# EAGLE design ZED-F9P GNSS FeatherWing (EAGLE 9.4.1)
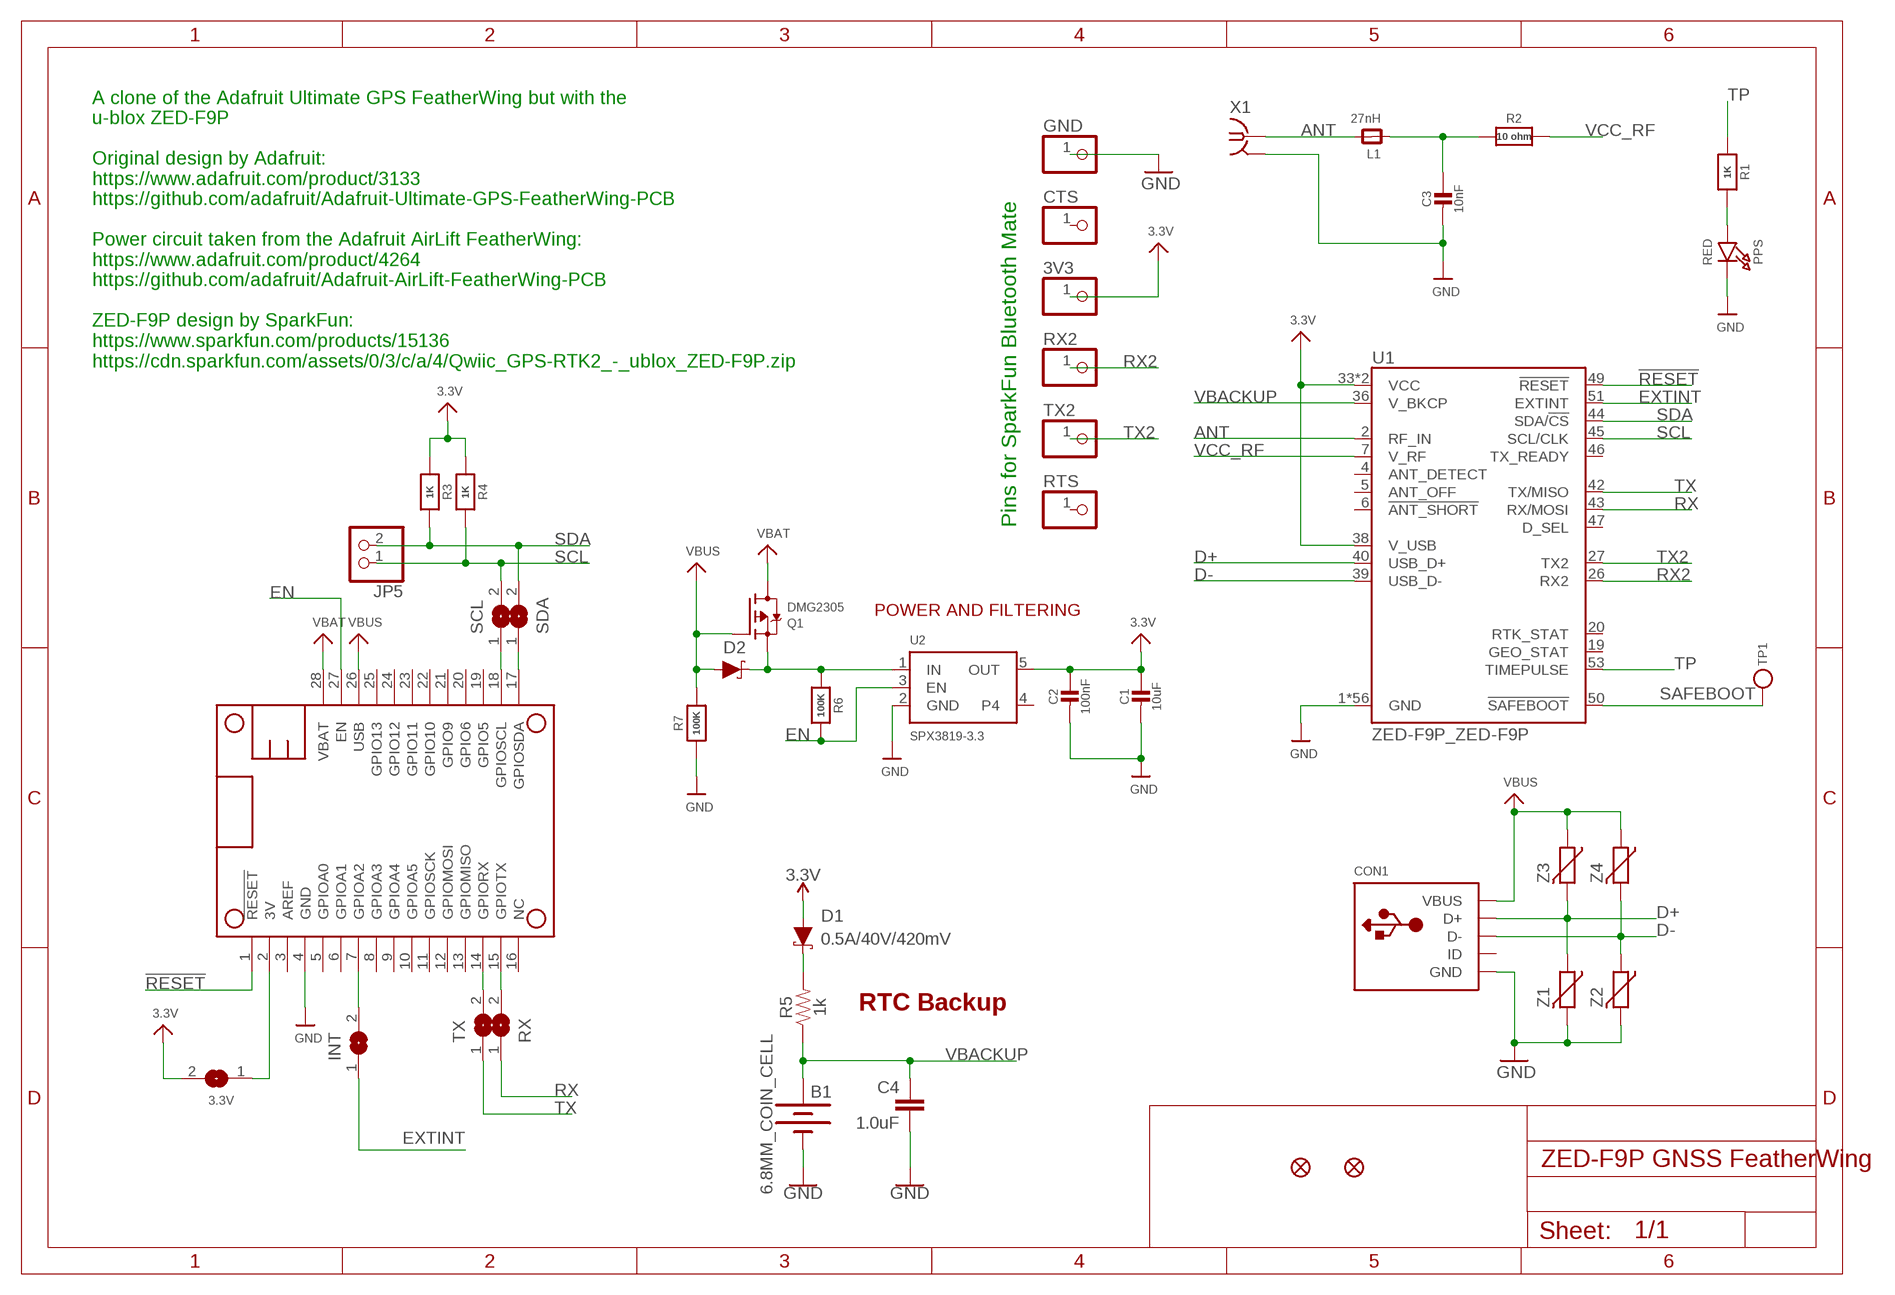
[diagram p0: schematic, sheet 1]

## Parts
3.3V  SOLDERJUMPER  [SOLDERJUMPER_ARROW_NOPASTE]
3V3  PINHD-1X1  [1X01]
B1  6.8MM_COIN_CELL  BATTERY-6.8MM_SMD  [BATTCON-6.8MM]
C1  10uF  CAP_CERAMIC0805-NOOUTLINE  [0805-NO]
C2  100nF  CAP_CERAMIC0805-NOOUTLINE  [0805-NO]
C3  10nF  CAP_CERAMIC0805-NOOUTLINE  [0805-NO]
C4  1.0uF  1.0UF-0603-16V-10%  [0603]
CON1  MICROBUILDER_USBFCI_10103594_CORRECTED  [MICROBUILDER_FCI_10103594_CORRECTED]
CTS  PINHD-1X1  [1X01]
D1  0.5A/40V/420mV  DIODE-SCHOTTKY-PMEG4005EJ  [SOD-323]
D2  0.5A/40V/420mV  DIODE-SCHOTTKY-PMEG4005EJ  [SOD-323]
FID1  FIDUCIAL""  [FIDUCIAL_1MM]
FID2  FIDUCIAL""  [FIDUCIAL_1MM]
GND  PINHD-1X1  [1X01]
INT  SOLDERJUMPERCLOSED  [SOLDERJUMPER_CLOSEDWIRE]
JP5  HEADER-1X2ROUND  [1X02_ROUND]
L1  27nH  FERRITE-0805NO  [0805-NO]
MS1  MICROBUILDER_FEATHERWINGMICROBUILDER_FEATHERWING_HOLES  [MICROBUILDER_FEATHERWING_HOLES]
PPS  RED  LED0805_NOOUTLINE  [CHIPLED_0805_NOOUTLINE]
Q1  DMG2305  MOSFET-P  [SOT23-R]
R1  1K  RESISTOR_0603_NOOUT  [0603-NO]
R2  10 ohm  RESISTOR0805_NOOUTLINE  [0805-NO]
R3  1K  RESISTOR_0603_NOOUT  [0603-NO]
R4  1K  RESISTOR_0603_NOOUT  [0603-NO]
R5  1k  1KOHM-0603-1/10W-1%  [0603]
R6  100K  RESISTOR_0603_NOOUT  [0603-NO]
R7  100K  RESISTOR_0603_NOOUT  [0603-NO]
RTS  PINHD-1X1  [1X01]
RX  SOLDERJUMPERCLOSED  [SOLDERJUMPER_CLOSEDWIRE]
RX2  PINHD-1X1  [1X01]
SCL  SOLDERJUMPERCLOSED  [SOLDERJUMPER_CLOSEDWIRE]
SDA  SOLDERJUMPERCLOSED  [SOLDERJUMPER_CLOSEDWIRE]
TP1  TESTPOINTROUND1.5MM  [TESTPOINT_ROUND_1.5MM]
TX  SOLDERJUMPERCLOSED  [SOLDERJUMPER_CLOSEDWIRE]
TX2  PINHD-1X1  [1X01]
U1  ZED-F9P_ZED-F9P  [ZED-F9P_ZED-F9P]
U2  SPX3819-3.3  VREG_SOT23-5  [SOT23-5]
X1  SMA-142-0711-821/826  [J502-ND-142-0711-821/826]
Z1  CG0603MLC-05E  0010_BRNCG0603MLC-05E  [CT/CN0603]
Z2  CG0603MLC-05E  0010_BRNCG0603MLC-05E  [CT/CN0603]
Z3  CG0603MLC-05E  0010_BRNCG0603MLC-05E  [CT/CN0603]
Z4  CG0603MLC-05E  0010_BRNCG0603MLC-05E  [CT/CN0603]

## Nets
3.3V: 3.3V.2 3V3.1 C1.1 C2.1 D1.A R3.1 R4.1 U1.33(VCC) U1.34(VCC) U1.38(V_USB) U2.5(OUT)
3V: 3.3V.1 MS1.2(3V)
!RESET: MS1.1(!RESET) U1.49(!RESET!)
ANT: L1.2 U1.2(RF_IN) X1.1
D+: CON1.D+ U1.40(USB_D+) Z1.1 Z3.2
D-: CON1.D- U1.39(USB_D-) Z2.1 Z4.2
EN: MS1.27(EN) R6.2 U2.3(EN)
EXTINT: INT.1 U1.51(EXTINT)
GND: B1.- C1.2 C2.2 C3.2 C4.2 CON1.BASE@1(GND) CON1.BASE@2(GND) CON1.GND CON1.SPRT@1(GND) CON1.SPRT@2(GND) CON1.SPRT@3(GND) CON1.SPRT@4(GND) GND.1 MS1.4(GND) PPS.C R7.1 U1.1(GND) U1.3(GND) U1.12(GND) U1.14(GND) U1.32(GND) U1.37(GND) U1.41(GND) U1.48(GND) U1.55(GND) U1.56(GND) U1.57(GND) U1.58(GND) U1.59(GND) U1.60(GND) U1.61(GND) U1.62(GND) U1.63(GND) U1.64(GND) U1.65(GND) U1.66(GND) U1.67(GND) U1.68(GND) U1.69(GND) U1.70(GND) U1.71(GND) U1.72(GND) U1.73(GND) U1.74(GND) U1.75(GND) U1.76(GND) U1.77(GND) U1.78(GND) U1.79(GND) U1.80(GND) U1.81(GND) U1.82(GND) U1.83(GND) U1.84(GND) U1.85(GND) U1.86(GND) U1.87(GND) U1.88(GND) U1.89(GND) U1.90(GND) U1.91(GND) U1.92(GND) U1.93(GND) U1.94(GND) U1.95(GND) U1.96(GND) U1.97(GND) U1.98(GND) U1.99(GND) U1.100(GND) U1.101(GND) U1.102(GND) U2.2(GND) X1.G@1 X1.G@2 X1.G@3 X1.G@4 Z1.2 Z2.2
N$1: MS1.18(GPIOSCL) SCL.1
N$2: PPS.A R1.2
N$3: MS1.17(GPIOSDA) SDA.1
N$4: C3.1 L1.1 R2.1
N$5: MS1.14(GPIORX) TX.2
N$6: MS1.15(GPIOTX) RX.2
N$7: INT.2 MS1.7(GPIOA2)
N$8: D1.C R5.2
N$10: D2.C Q1.2(S) R6.1 U2.1(IN)
RX: RX.1 U1.43(RX/MOSI)
RX2: RX2.1 U1.26(RX2)
SAFEBOOT: TP1.P$1 U1.50(!SAFEBOOT!)
SCL: JP5.1 R4.2 SCL.2 U1.45(SCL/CLK)
SDA: JP5.2 R3.2 SDA.2 U1.44(SDA/!CS!)
TP: R1.1 U1.53(TIMEPULSE)
TX: TX.1 U1.42(TX/MISO)
TX2: TX2.1 U1.27(TX2)
VBACKUP: B1.+ C4.1 R5.1 U1.36(V_BKCP)
VBAT: MS1.28(VBAT) Q1.3(D)
VBUS: CON1.VBUS D2.A MS1.26(USB) Q1.1(G) R7.2 Z3.1 Z4.1
VCC_RF: R2.2 U1.7(V_RF)
Unconnected: CON1.ID CTS.1 MS1.3(AREF) MS1.5(GPIOA0) MS1.6(GPIOA1) MS1.8(GPIOA3) MS1.9(GPIOA4) MS1.10(GPIOA5) MS1.11(GPIOSCK) MS1.12(GPIOMOSI) MS1.13(GPIOMISO) MS1.16(NC) MS1.19(GPIO5) MS1.20(GPIO6) MS1.21(GPIO9) MS1.22(GPIO10) MS1.23(GPIO11) MS1.24(GPIO12) MS1.25(GPIO13) RTS.1 U1.4(ANT_DETECT) U1.5(ANT_OFF) U1.6(!ANT_SHORT!) U1.19(GEO_STAT) U1.20(RTK_STAT) U1.46(TX_READY) U1.47(D_SEL) U2.4

## Notes on the sheet
- A clone of the Adafruit Ultimate GPS FeatherWing but with the
  u-blox ZED-F9P
  
  Original design by Adafruit:
  https://www.adafruit.com/product/3133
  https://github.com/adafruit/Adafruit-Ultimate-GPS-FeatherWing-PCB
  
  Power circuit taken from the Adafruit AirLift FeatherWing:
  https://www.adafruit.com/product/4264
  https://github.com/adafruit/Adafruit-AirLift-FeatherWing-PCB
  
  ZED-F9P design by SparkFun:
  https://www.sparkfun.com/products/15136
  https://cdn.sparkfun.com/assets/0/3/c/a/4/Qwiic_GPS-RTK2_-_ublox_ZED-F9P.zip
- Pins for SparkFun Bluetooth Mate
- POWER AND FILTERING
- RTC Backup

## Library data of the parts
3.3V = microbuilder:SOLDERJUMPER: SMD Solder JUMPER Solder the two pads together to create a connection, or remove the solder to break it. REFLOW - Use this footprint for solder paste and reflow ovens. WAVE - Use this footprint for hand-soldering (larger pads). CLOSED - Has a trace between the two pads to ensure it is closed by default. The trace needs to be cut to disable the jumper, and can be closed again by creating a solder bridge between the two pads.; BOM: EXCLUDE
3V3 CTS GND RTS RX2 TX2 = adafruit:PINHD-1X1: Pin header 1x1 for 0.1" spacing With round pins
B1 = SparkFun-Batteries:BATTERY: Battery - Single Cell A variety of battery chemistries, sizes, and footprints. Device List: 20MM_PTH - Coin Cell Battery Holder - 20mm (PTH) <https://www.sparkfun.com/products/783> 20MM_PTH_KIT- Coin Cell battery Holder - 20 mm (PTH) <http://www.sparkfun.com/products/783>kit version with special mask 6.8MM_PTH - Coin Cell Battery Holder - 6.8MM(SMD) <https://www.digikey.com/product-detail/en/seiko-instruments/MS621FE-FL11E/728-1057-ND/1889208?WT.srch=1&gclid=CNOQ5a6LzdQCFZS2wAodXCkE0g> 12MM_SMD - Coin Cell Battery Holder - 12mm (SMD) <https://www.sparkfun.com/products/10592> 12MM_PTH - Coin Cell Battery Holder - 12mm (PTH) <https://www.sparkfun.com/products/7948> 20MM_SMD - 20mm Coin Cell Battery Holder (SMD) (2 legs) Used on the Big Time Watch Kit <https://www.sparkfun.com/products/11734> 20MM_SMD_4LEGS - Coin Cell Battery Holder - 20mm (SMD) <https://www.sparkfun.com/products/11892> 20MM_SMD_4LEGS_OVERPASTE - Coin Cell Battery Holder - 20mm (SMD) <https://www.sparkfun.com/products/11892> (Over-paste on the legs) 24.5MM_PTH - Coin Cell Battery Holder - 24.5mm (PTH) <https://www.sparkfun.com/products/8863> 9V - 9V Battery Holder - PC Mount Used on the SparkFun SparkPunk Sound Kit <https://www.sparkfun.com/products/11177> and SparkFun SparkPunk Sequencer Kit <https://www.sparkfun.com/products/12707> 18650 - Battery Holder - 18650 (PTH) <https://www.sparkfun.com/products/13113> AA - Battery Holder - 1xAA (PTH) <https://www.sparkfun.com/products/7949> AAA - Battery Holder - 1xAAA (PTH) <https://www.sparkfun.com/products/12718> AA_KIT - Battery Holder - 1xAA (PTH) <https://www.sparkfun.com/products/7949> Special kit package - pads only have exposed copper on one side of the board. AAA_KIT - Battery Holder - 1xAAA (PTH) <https://www.sparkfun.com/products/12718> Special kit package - pads only have exposed copper on one side of the board.; PROD_ID: BATT-13734
C1-C3 = microbuilder:CAP_CERAMIC: Ceramic Capacitors For new designs, use the packages preceded by an '_' character since they are more reliable: The following footprints should be used on most boards: _0402 - Standard footprint for regular board layouts _0603 - Standard footprint for regular board layouts _0805 - Standard footprint for regular board layouts _1206 - Standard footprint for regular board layouts For extremely tight-pitch boards where space is at a premium, the following 'micro-pitch' footprints can be used (smaller pads, no silkscreen outline, etc.): _0402MP - Micro-pitch footprint for very dense/compact boards _0603MP - Micro-pitch footprint for very dense/compact boards _0805MP - Micro-pitch footprint for very dense/compact boards _1206MP - Micro-pitch footprint for very dense/compact boards
C4 = SparkFun-Capacitors:1.0UF: 1µF ceramic capacitors A capacitor is a passive two-terminal electrical component used to store electrical energy temporarily in an electric field.; PROD_ID: CAP-00868
CON1 = Iridium_9603_Beacon:MICROBUILDER_USB: USB Connectors USBMINIB - Surface Mount Female Mini-B USB Connector 4UConnector: 06564
D1 D2 = SparkFun-DiscreteSemi:DIODE-SCHOTTKY: Schottky diode A Schottky diode is a semiconductor diode which has a low forward voltage drop and a very fast switching action.; PROD_ID: DIO-10955
FID1 FID2 = microbuilder:FIDUCIAL: Fiducial Alignment Points Various fiducial points for machine vision alignment.; BOM: EXCLUDE
INT RX SCL SDA TX = microbuilder:SOLDERJUMPER: SMD Solder JUMPER Solder the two pads together to create a connection, or remove the solder to break it. REFLOW - Use this footprint for solder paste and reflow ovens. WAVE - Use this footprint for hand-soldering (larger pads). CLOSED - Has a trace between the two pads to ensure it is closed by default. The trace needs to be cut to disable the jumper, and can be closed again by creating a solder bridge between the two pads.
JP5 = microbuilder:HEADER-1X2: PIN HEADER
L1 = microbuilder:FERRITE: Ferrite Bead 0603 MMZ1608B121C - 120 Ohm @ 100MHz, 600mA, 0.15 Ohm DC Resistance - Digikey: 445-2164-1-ND BK1608HW121-T - 120 Ohm, 600mA Ferrite Chip - Digikey: 587-1876-2-ND 0805 HZ0805B272R-10 - 2.7K Ohm @ 100MHz, 200mA, 0.8 Ohm DC Resistance - Digikey: 240-2504-1-ND (see also Murata BLM21BD272SN1L) MMZ2012Y152B - 1.5K Ohm @ 100MHz, 500mA, 0.4 Ohm DC Resistance - Digikey: 445-1560-1-ND - Mainly for high frequency (80-400MHz) MMZ2012R102A - 1K Ohm @ 100MHz, 500mA, 0.3 Ohm DC Resistance - Digikey: 445-1555-2-ND - More general purpose (10-200MHz)
MS1 = NEO-M8T GNSS FeatherWing:MICROBUILDER_FEATHERWING
PPS = microbuilder:LED: LED 0603 - 0603 Surface Mount Package 2mA: Green LED - Low Power (3.9mcd, 2ma, 1.7Vf) - Digikey: 475-2709-2-ND Orange LED - Low Power (9.8mcd, 2ma, 1.8Vf) - Digikey: 475-1194-2-ND Red LED - Low Power (5mcd, 2ma, 1.8Vf) - Digikey: 475-1195-2-ND Yellow LED - Low Power (7mcd, 2ma, 1.8Vf) - Digikey: 475-1196-2-ND 5mA: Blue LED - Low Power (17mcd, 5ma, 2.9Vf) - Digikey: LNJ937W8CRACT-ND 0805 - 0805 Surface Mount Package 2mA: Red LED (8.8mcd, 2mA, 1.8Vf, Clear) - Low Power [Digikey: 475-2510-1-ND] Green LED (5mcd, 2mA, 1.8Vf, Clear) - Low Power [Digikey: 475-2730-1-ND] Yellow LED (11.3mcd, 2mA, 1.8Vf, Clear) - Low Power [Digikey: 475-2555-1-ND] 20mA: Red LED (104mcd, 20mA, Diffused) - LS R976 [Digikey: 475-1278-6-ND] Red LED (12mcd, 20mA, 2.0Vf, Clear) - APT2012EC [Digikey: 754-1128-1-ND] Green LED (15mcd, 20mA, 2.2Vf, Clear) - APT2012GC [Digikey: 754-1131-1-ND] Orange LED (160mcd, 20mA, 2.1Vf, Clear) - APT2012SECK [Digikey: 754-1130-1-ND] 1206 - 1206 Surface Mount Package Green LED (26mcd, 20mA, Diffused) - LG N971 [Digikey: 475-1407-6-ND] Red LED (15mcd, 20mA, Diffused) - LH N974 [Digikey: 475-1416-6-ND] Cree - Cree High-Power Surface Mount LEDs XPEBWT-L1-0000-00D50 - White 111lm 350mA 2.9Vf 6200K 110° XTEAWT-00-0000-00000LEE3 - White 114lm 350mA 2.85Vf 5000K 115° Everlight - Everlight 45-21 Series Surface Mount LEDs 45-21/QK2C-B2832AC2CB2/2T - Warm White 2000mcd 20mA 3.25Vf 3050K 120° 45-21/LK2C-B38452C4CB2/2T - Nuetral White 2000mcd 20mA 3.25Vf 4150K 120° 45-21/LK2C-B50634C6CB2/2T - Cold White 2200mcd 20mA 3.25Vf 5650K 120° PLCC2 Reverse Mount LS T77K-J1L2-1-0-2-R18-Z - Red 11.25mcd 2mA 1.8Vf 630nm 120° LO T77K-L1M2-24-Z - Orange 19.6mcd 2mA 1.8Vf 606nm 120° LY T77K-K2M1-26-Z - Yellow 15.7mcd 2mA 1.8Vf 587nm 120°
Q1 = microbuilder:MOSFET-P: P-Channel Mosfet LEGEND VDS: Voltage Drain-Source ID: Drain Current RDS(ON): Drain-Source On-State Resistance VGS(TH): Gate-Source Threshold Voltage CISS: Drain-Source Input Capacitance SOT-23 Name VDS ID RDS(ON) VGS(TH) CISS Order Number IRLML5103 30V 760mA 600 mOhm -- 75pF @ 25V Digikey: IRLML5103PBFCT-ND IRLML6401 12V 4.3A 50 mOhm 950mV @ 250µA 830pF @ 10V Digikey: IRLML6401PBFTR-ND NTR0202PL 20V 400mA 800 mOhm 2.3V @ 250uA 70pF @ 5V Digikey: NTR0202PLT1GOSTR-ND NTR4101PT1G 20V 1.8A 85 mOhm 1.2V @ 250uA 675pF @ 10V Digikey: NTR4101PT1GOSCT-ND DMP2004K 20V 600mA 900 mOhm 1V @ 250uA 175pF @ 16V Digikey: DMP2004KDICT-ND PMV65XP 20V 3.9A 76 mOhm 950mV @ 1mA 725pF @ 20V Digikey: 568-2358-2-ND TO-252 Name VDS ID RDS(ON) VGS(TH) CISS Order Number AOD417 30V 25A 34 mOhm 3V @ 250µA 920pF @ 15V Digikey: 785-1106-2-ND PowerPak Name VDS ID RDS(ON) VGS(TH) CISS Order Number AON7401 30V 12A 14 mOhm 3V @ 250µA 2600pF @ 15V Digikey: 785-1302-1-ND
R1-R4 R6 R7 = microbuilder:RESISTOR: Resistors For new designs, use the packages preceded by an '_' character since they are more reliable: The following footprints should be used on most boards: _0402 - Standard footprint for regular board layouts _0603 - Standard footprint for regular board layouts _0805 - Standard footprint for regular board layouts _1206 - Standard footprint for regular board layouts For extremely tight-pitch boards where space is at a premium, the following 'micro-pitch' footprints can be used (smaller pads, no silkscreen outline, etc.): _0402MP - Micro-pitch footprint for very dense/compact boards _0603MP - Micro-pitch footprint for very dense/compact boards _0805MP - Micro-pitch footprint for very dense/compact boards _1206MP - Micro-pitch footprint for very dense/compact boards
R5 = SparkFun-Resistors:1KOHM: 1kΩ resistor A resistor is a passive two-terminal electrical component that implements electrical resistance as a circuit element. Resistors act to reduce current flow, and, at the same time, act to lower voltage levels within circuits. - Wikipedia; PROD_ID: RES-07856
TP1 = microbuilder:TESTPOINT: Test Point Various test points for characterisation and PCB testing TESTPOINT_SMT - Compact Surface Mount Test Point [Digikey: 5016KTR-ND]
U1 = Qwiic GPS-RTK2 - ublox ZED-F9P:ZED-F9P_ZED-F9P
U2 = microbuilder:VREG_SOT23-5: SOT23-5 Fixed Voltage Regulators Part Current Out V Out V In V Dropout θJA (°C/W) TJ (°C) Digikey Part No. ADP121 150mA 3.3V 3.4-5.5V 0.09V @ 150mA -- -- ADP121-AUJZ33R7CT-ND ADP121 150mA 3.0V 3.1-5.5V 0.09V @ 150mA -- -- ADP121-AUJZ30R7CT-ND ADP122 300mA 3.3V 3.4-5.5V 0.085V @ 300mA -- -- ADP122AUJZ-3.3-R7CT-ND ADP1712 300mA 3.3V 3.5-5.5V 0.17V @ 300mA -- -- ADP1712AUJZ-3.3-R7TR-ND AP7311 (Low Cost) 150mA 3.3V 3.5-6V 0.15V @ 150mA -- -- AP7311-33WG-7DICT-ND LD39015M18R 150mA 1.8V 1.9V-5.5V 0.08V @ 100mA -- -- 497-6977-1-ND LP2985A-33DBVR 150mA 3.3V 3.3-16V 0.28V @ 150mA 206 150 296-18479-1-ND MCP1824T-3302E/OT 300mA 3.3V 3.5V-6V 0.2V @ 300mA -- -- MCP1824T-3302E/OTCT-ND MIC5205-2.5YM5 TR 150mA 2.5V 2.7-16V 0.165V @ 150mA -- -- 576-1257-2-ND MIC5205-3.0YM5 TR 150mA 3.0V 3.2V-16V 0.165V @ 150mA -- -- 576-1258-2-ND MIC5205-3.3YM5 TR 150mA 3.3V 3.5V-16V 0.165V @ 150mA -- -- 576-1259-2-ND TPS780330220 150mA 3.3V+2.2V 3.6-5.5V 250mV Max -- -- 296-23332-1-ND TDA3663/N1,135 100mA 3.3V 3.5-45V 0.18V @ 50mA -- -- 568-5343-1-ND Max operating temp can be calculated using θJA, TJ (max junction temperature), and power in watts. Set the "Maximum Ambient Temperature" until it reaches TJ ("Max Junction Temperature"), which is the absolute limit for safe use of the regulator: Heat Sink Temperature Calculator <http://www.daycounter.com/Calculators/Heat-Sink-Temperature-Calculator.phtml> For example, With 12V source into a 3.3V LP2985 and a 30mA load, we are dissipating (12V-3.3V) * 0.03A = 0.261W. With a θJA of 206 °C/W, a TJ of 150°C, and 261mW we can safely use the chip without a heat sink up to 75°C (=147.1°C Junction Temperature).
X1 = con-coax:SMA-: SMA 50 Ohm End Launch Jack Receptacle - Round Contact Johnson Components Source: www.johnsoncomponents.com .. J502-ND.pdf; MF: JOHNSON COMPONENTS; MPN: 142-0711-821; OC_FARNELL: 1019328; OC_NEWARK: 16F3627
Z1-Z4 = Protezione:0010_BRNCG0603MLC-05E: CG0603MLC-05E; MONTHLY_USAGE: _____; PART_NUMBER: BRNCG0603MLC-05E; PRICE: _____; SUPPLIER: _____; TYPE: Protezione; VALUE: BRNCG0603MLC-05E

## Net classes
2 3.3V: width 0.508 mm

## Board
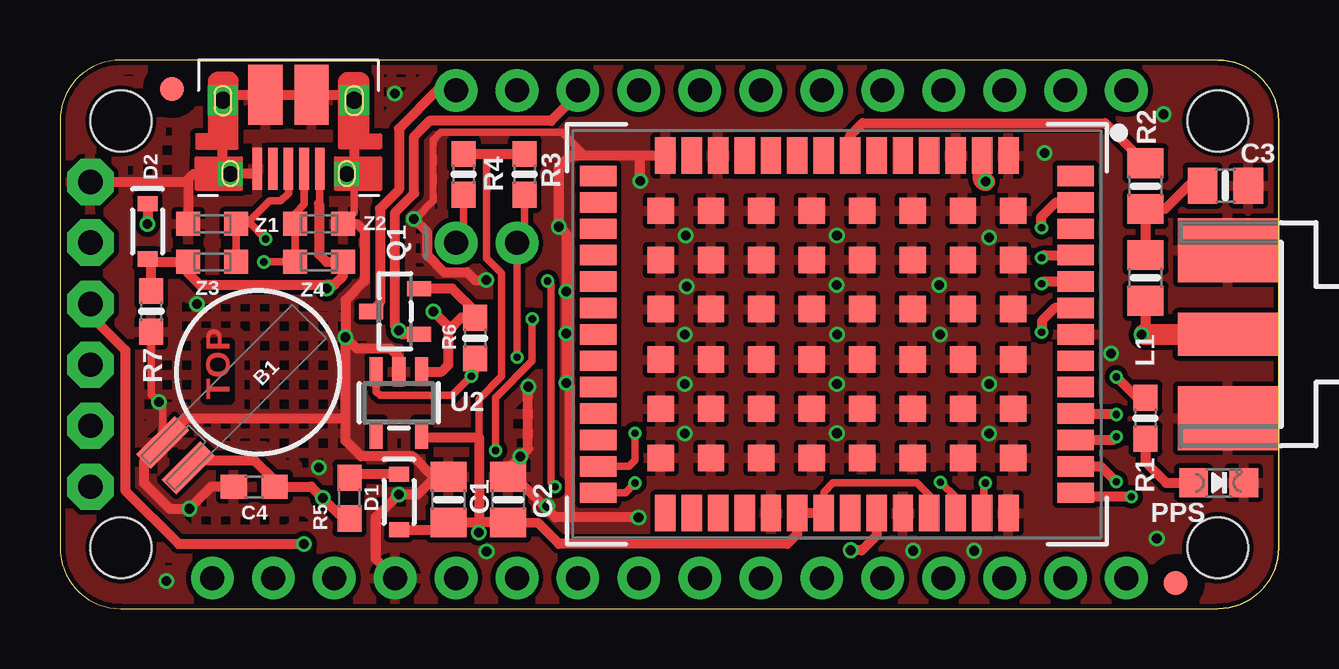
[diagram p1: board, top side]
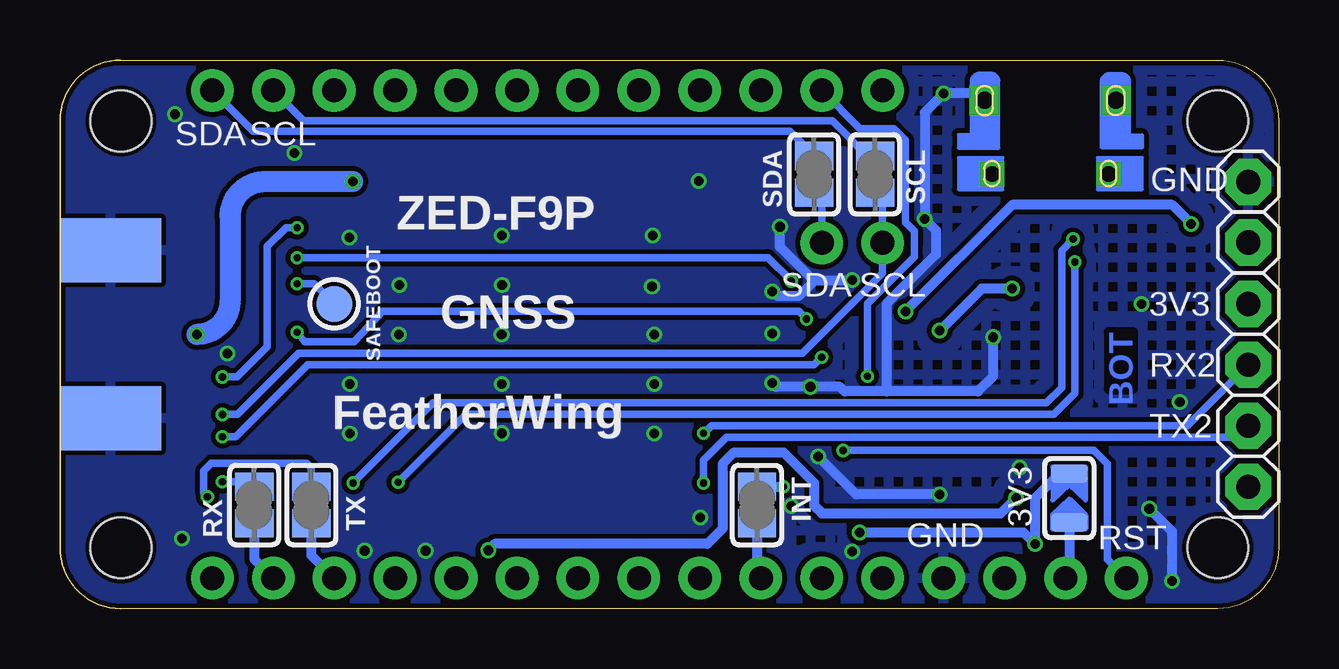
[diagram p2: board, bottom side, seen from below]

Size 50.8 x 22.86 mm. Coordinates in mm from the lower left corner, seen from the top.
Outline: 48.26,22.86 arc-90 50.8,20.32 50.8,2.54 arc-90 48.26,0
Copper layers (1*16): Top 0.018mm / dielectric 1.55mm / Bottom 0.018mm
Design rules "Multi-CB_2L_125um-Tracks_OL35um *": minimum track width 0.125mm, minimum drill 0.2mm, track to track 0.125mm, track to pad 0.125mm, pad to pad 0.125mm, via to via 0.125mm, smd to smd 0mil, copper to edge 0.2mm, drill to drill 0.2mm, minimum pad ring 0.125mm, minimum via ring 0.125mm, stop-mask expansion 2mil, vias tented up to drill 0.45mm, thermal gap 0.2mm

### Footprints (pad centres in the part's own frame; a part is rotated, then mirrored left to right if it is on the bottom)
SOLDERJUMPER_ARROW_NOPASTE = smd 0.762 x 1.524: 1 -1.016,0; 2 1.016,0
1X01 = drill 1.016 pad 1.93 octagon: 1 0,0
BATTCON-6.8MM = smd 2.25 x 0.85: + 4.87,0.75; - 4.87,-0.75
0805-NO = smd 1.24 x 1.5: 1 -0.95,0; 2 0.95,0
0603 = smd 1.1 x 1: 1 -0.85,0; 2 0.85,0
MICROBUILDER_FCI_10103594_CORRECTED = smd 1.425 x 2.5: BASE@1 -0.963,1.45; BASE@2 0.963,1.45 | smd 0.4 x 1.75: D+ 0,4.525; D- -0.65,4.525; GND 1.3,4.525; ID 0.65,4.525; VBUS -1.3,4.525 | drill 0.7 pad 1.25 square: SPRT@1 -2.736,1.679; SPRT@2 2.736,1.679 | drill 0.65 pad 1.016 square: SPRT@3 -2.426,4.747; SPRT@4 2.426,4.747
SOD-323 = smd 0.63 x 0.83: A 1.15,0; C -1.15,0
FIDUCIAL_1MM = smd 1 x 1: 1 0,0
SOLDERJUMPER_CLOSEDWIRE = smd 1.168 x 1.6: 1 -0.762,0; 2 0.762,0 | smd 0.635 x 0.203: WIRE 0,0
1X02_ROUND = drill 1 pad 1.778: 1 -1.27,0; 2 1.27,0
MICROBUILDER_FEATHERWING_HOLES = drill 1 pad 1.778: 1 6.35,1.27; 2 8.89,1.27; 3 11.43,1.27; 4 13.97,1.27; 5 16.51,1.27; 6 19.05,1.27; 7 21.59,1.27; 8 24.13,1.27; 9 26.67,1.27; 10 29.21,1.27; 11 31.75,1.27; 12 34.29,1.27; 13 36.83,1.27; 14 39.37,1.27; 15 41.91,1.27; 16 44.45,1.27; 17 44.45,21.59; 18 41.91,21.59; 19 39.37,21.59; 20 36.83,21.59; 21 34.29,21.59; 22 31.75,21.59; 23 29.21,21.59; 24 26.67,21.59; 25 24.13,21.59; 26 21.59,21.59; 27 19.05,21.59; 28 16.51,21.59 | hole 2.54: 48.26,20.32; 48.26,2.54; 2.54,20.32; 2.54,2.54
CHIPLED_0805_NOOUTLINE = smd 1.2 x 1.2: A 0,-1.05; C 0,1.05
SOT23-R = smd 0.635 x 1.016: 1 -0.95,-1; 2 0.95,-1; 3 0,1
0603-NO = smd 1.075 x 1: 1 -0.85,0; 2 0.85,0
TESTPOINT_ROUND_1.5MM = smd 1.5 x 1.5: P$1 0,0
ZED-F9P_ZED-F9P = smd 0.85 x 1.52: 1 -7.15,-7.45; 2 -6.05,-7.45; 3 -4.95,-7.45; 4 -3.85,-7.45; 5 -2.75,-7.45; 6 -1.65,-7.45; 7 -0.55,-7.45; 8 0.55,-7.45; 9 1.65,-7.45; 10 2.75,-7.45; 11 3.85,-7.45; 12 4.95,-7.45; 13 6.05,-7.45; 14 7.15,-7.45; 28 7.15,7.45; 29 6.05,7.45; 30 4.95,7.45; 31 3.85,7.45; 32 2.75,7.45; 33 1.65,7.45; 34 0.55,7.45; 35 -0.55,7.45; 36 -1.65,7.45; 37 -2.75,7.45; 38 -3.85,7.45; 39 -4.95,7.45; 40 -6.05,7.45; 41 -7.15,7.45 | smd 1.52 x 0.85: 15 9.95,-6.6; 16 9.95,-5.5; 17 9.95,-4.4; 18 9.95,-3.3; 19 9.95,-2.2; 20 9.95,-1.1; 21 9.95,0; 22 9.95,1.1; 23 9.95,2.2; 24 9.95,3.3; 25 9.95,4.4; 26 9.95,5.5; 27 9.95,6.6; 42 -9.95,6.6; 43 -9.95,5.5; 44 -9.95,4.4; 45 -9.95,3.3; 46 -9.95,2.2; 47 -9.95,1.1; 48 -9.95,0; 49 -9.95,-1.1; 50 -9.95,-2.2; 51 -9.95,-3.3; 52 -9.95,-4.4; 53 -9.95,-5.5; 54 -9.95,-6.6 | smd 1.1 x 1.1: 55 -1.05,-1.05; 56 -3.15,-1.05; 57 -5.25,-1.05; 58 -7.35,-1.05; 59 -1.05,-3.1; 60 -3.15,-3.1; 61 -5.25,-3.1; 62 -7.35,-3.1; 63 -1.05,-5.15; 64 -3.15,-5.15; 65 -5.25,-5.15; 66 -7.35,-5.15; 67 -1.05,5.15; 68 -3.15,5.15; 69 -5.25,5.15; 70 -7.35,5.15; 71 -1.05,3.1; 72 -3.15,3.1; 73 -5.25,3.1; 74 -7.35,3.1; 75 -1.05,1.05; 76 -3.15,1.05; 77 -5.25,1.05; 78 -7.35,1.05; 79 1.05,1.05; 80 3.15,1.05; 81 5.25,1.05; 82 7.35,1.05; 83 1.05,3.1; 84 3.15,3.1; 85 5.25,3.1; 86 7.35,3.1; 87 1.05,5.15; 88 3.15,5.15; 89 5.25,5.15; 90 7.35,5.15; 91 1.05,-5.15; 92 3.15,-5.15; 93 5.25,-5.15; 94 7.35,-5.15; 95 1.05,-3.1; 96 3.15,-3.1; 97 5.25,-3.1; 98 7.35,-3.1; 99 1.05,-1.05; 100 3.15,-1.05; 101 5.25,-1.05; 102 7.35,-1.05
SOT23-5 = smd 0.55 x 1.2: 1 -0.95,-1.3; 2 0,-1.3; 3 0.95,-1.3; 4 0.95,1.3; 5 -0.95,1.3
J502-ND-142-0711-821/826 = smd 4.191 x 1.778: 1 2.115,0 | smd 4.191 x 2.667: G@1 2.115,3.495; G@2 2.115,-3.495 | smd 4.191 x 2.667 bottom: G@3 2.115,3.495; G@4 2.115,-3.495
CT/CN0603 = smd 1 x 1: 1 -1,0; 2 1,0

### Placement (x,y rotation side)
3.3V  8.73,4.6 90 bottom
3V3  1.27,12.7 0 bottom
B1  8.26,9.84 225 top
C1  16.2,4.54 90 top
C2  18.68,4.54 90 top
C3  48.58,17.62 0 top
C4  8.1,5.08 180 top
CON1  9.53,22.86 180 top
CTS  1.27,15.26 0 bottom
D1  14.13,4.45 270 top
D2  3.65,15.72 270 top
FID1  4.67,21.65 0 top
FID2  46.51,1.06 0 top
GND  1.27,17.78 0 bottom
INT  21.75,4.32 270 bottom
JP5  17.78,15.24 0 top
L1  45.24,13.78 270 top
MS1  0,0 0 top
PPS  48.3,5.24 270 top
Q1  13.97,12.38 90 top
R1  45.24,7.93 270 top
R2  45.24,17.61 90 top
R3  19.37,18.1 270 top
R4  16.83,18.1 270 top
R5  12.06,4.6 90 top
R6  17.3,11.27 270 top
R7  3.81,12.38 90 top
RTS  1.27,5.08 0 bottom
RX  42.7,4.32 270 bottom
RX2  1.27,10.16 0 bottom
SCL  16.83,18.1 270 bottom
SDA  19.37,18.1 270 bottom
TP1  39.37,12.7 0 bottom
TX  40.32,4.32 270 bottom
TX2  1.27,7.62 0 bottom
U1  32.38,11.43 180 top
U2  14.13,8.57 180 top
X1  50.8,11.43 180 top
Z1  6.35,16.03 180 top
Z2  10.79,16.03 0 top
Z3  6.35,14.45 0 top
Z4  10.79,14.45 180 top

### Tracks (layer width: path | path; a pad name or v marks a point on that pad's centre or on a via)
3.3V  (via drill 0.4)
  Top 0.305: U1.34 31.84,4.85 32.23,5.24 35.72,5.24 36.23,4.72 U1.38 | 17.46,7.14 17.46,8.73 18.41,9.68 18.41,13.97 17.78,14.61 17.78,18.95
  Top 0.406: U1.34 U1.33 30.73,3.11 30.32,2.7 20.8,2.7 19.92,3.57 C2.1 17.46,3.59 | D1.A 15.9,3.29 C1.1 17.46,3.59 | R4.1 17.78,18.95 R3.1 | 3V3.1 1.27,12.22 2.72,10.77 2.72,4.92 4.95,2.7 v10.16,2.7 | 17.46,3.59 17.46,7.14 15.21,7.14 U2.5 | 17.46,3.59 v17.46,3.17
  Bottom 0.406: v17.46,3.17 10.64,3.17 v10.16,2.7 10.16,4.6 9.14,5.62 3.3V.2
3V
  Bottom 0.406: 3.3V.1 8.73,1.43 MS1.2
!RESET  (via drill 0.3)
  Top 0.305: v18.15,6.59 18.15,8.79 19.68,10.32 v19.68,12.06
  Top 0.406: v40.92,11.51 40.94,11.53 40.94,11.99 41.48,12.53 U1.49
  Bottom 0.305: v40.92,11.51 40.6,11.11 38.53,11.11 37.35,12.38 20,12.38 v19.68,12.06 | MS1.1 7.14,2.06 7.14,6.03 7.7,6.59 v18.15,6.59
ANT  (via drill 0.4)
  Top 0.406: 45.19,11.43 arc90 v45.09,11.43 45.24,11.59 L1.2
  Top 0.762: U1.2 38.44,17.95 arc90 v38.59,17.79
  Top 0.879: 45.19,11.43 X1.1
  Bottom 0.879: v38.59,17.79 42.26,17.79 arc-90 43.72,16.34 43.72,12.8 arc90 v45.09,11.43
D+  (via drill 0.3)
  Top 0.305: CON1.D+ 9.53,17.3 9.21,16.99 8.73,16.99 7.78,16.03 Z1.1 | Z1.1 Z3.2 | v38.58,5.24 38.51,5.18 38.51,4.06 U1.40 | v8.57,15.4 7.94,16.03 Z1.1
  Bottom 0.305: v38.58,5.24 35.24,8.57 9.68,8.57 9.05,9.21 9.05,14.92 v8.57,15.4
D-  (via drill 0.3)
  Top 0.305: CON1.D- 10.18,16.84 9.79,16.46 Z2.1 Z4.2 v8.5,14.45 | U1.39 37.34,4.63 v36.7,5.27
  Bottom 0.305: v36.7,5.27 33.87,8.1 9.37,8.1 8.5,8.97 v8.5,14.45
EN  (via drill 0.3)
  Top 0.305: R6.2 17.3,9.84 v17.14,9.68 16.35,8.89 13.34,8.89 13.18,9.05 U2.3
  Bottom 0.305: MS1.27 17.46,20 16.03,20 15.56,19.53 15.56,16.1 15.19,15.72 15.19,15.24 15.19,14.66 17.14,12.7 v17.14,9.68
EXTINT  (via drill 0.3)
  Top 0.305: v20.32,13.65 20.48,13.49 20.48,5.24 v20.64,5.08
  Top 0.406: v40.92,14.62 41.02,14.73 U1.51
  Bottom 0.305: v40.92,14.62 21.29,14.62 v20.32,13.65
  Bottom 0.406: INT.1 v20.64,5.08
GND  (via drill 0.4)
  Top 0.305: Z2.2 12.26,16.5 12.26,18.11 | B1.- 4.28,8.45 v4.12,8.61 3.81,8.92 R7.1 | v14.76,16.23 14.8,16.23 15.56,16.99 15.56,19.53 15.87,19.84 20.94,19.84 21.9,18.88
  Top 0.406: Z1.2 5.35,17.78 5.24,17.78 | 6.79,18.11 CON1.SPRT@2 6.79,21.41 CON1.BASE@2 CON1.BASE@1 12.26,21.41 CON1.SPRT@1 12.26,18.11 CON1.SPRT@3 | CON1.GND 8.22,18.11 6.79,18.11 | GND.1 5.24,17.78 | 6.79,18.11 5.57,18.11 5.24,17.78 | C4.2 6.31,5.08 v5.39,4.16 4.57,4.16 3.49,5.24 3.49,6.14 B1.- 5.29,7.94 11.9,7.94 | MS1.4 13.18,2.06 13.18,3.81 v14.13,4.76 14.92,4.76 15.65,5.49 C1.2 15.56,5.49 14.71,6.34 12.55,6.34 11.9,6.99 11.9,7.94 | v19.52,9.24 19.52,6.66 v19.2,6.34 18.68,5.83 C2.2 18.97,5.47 20.65,3.8 21.11,3.8 | v24.12,3.8 21.24,3.8 21.24,9.27 v21.11,9.4 v21.11,11.47 v21.11,13.21 21.11,15.59 v20.79,15.91 20.79,18.41 21.26,18.88 21.9,18.88 24.29,18.88 | Z2.2 12.38,16.03 12.7,15.72 12.7,13.65 11.9,12.85 v11.9,11.31 | U2.2 14.13,10.48 13.78,10.83 12.38,10.83 v11.9,11.31 | 11.9,7.94 v11.9,11.31 | U1.14 24.29,18.88 | v24.18,17.82 24.18,18.77 24.29,18.88 | v17.77,13.69 17.3,13.69 16.96,14.02 16.01,14.02 15.29,14.74 15.29,15.69 v14.76,16.23
  Bottom 0.406: v4.44,1.15 4.44,3.21 v5.39,4.16 | v14.13,4.76 17.62,4.76 v19.2,6.34 | v21.11,9.4 20.95,9.24 v19.52,9.24 18.29,9.24 18.1,9.05 16.35,9.05 | CON1.SPRT@1 12.55,21.47 v13.96,21.47 14.76,20.67 v14.76,16.23 14.29,15.76 14.29,14.76 16.35,12.7 16.35,9.05 | v11.9,11.31 11.9,9.69 12.54,9.05 16.35,9.05 | 19.4,13.69 v17.77,13.69 | v20.79,15.91 20.79,15.08 19.4,13.69 | 19.4,13.69 19.4,13.62 20,13.02 20.91,13.02 v21.11,13.21
  other vias: 46.01,20.6 38.72,9.36 32.38,7.31 38.1,2.41 41.03,18.99 32.37,13.48 36.65,13.48 35.56,2.41 26.08,15.55 26.04,7.3 32.38,9.36 26.12,13.43 32.38,15.55 26.04,9.36 45.72,2.92 38.72,7.3 38.73,15.47 43.81,10.64 26.04,11.42 36.68,11.43 32.39,11.43 17.78,2.37 20.32,4.28 5.71,12.69 10.79,5.87
  pour Top (isolate 0.203, rank 2, hatched): 0,22.86 0,0 50.8,0 50.8,22.86
  pour Bottom (isolate 0.203, rank 2, hatched): 0,22.86 0,0 50.8,0 50.8,22.86
  pour Bottom (isolate 0.203): 20.32,22.86 20.32,0 50.8,0 50.8,22.86
  pour Top (isolate 0.203): 20.32,22.86 20.32,0 50.8,0 50.8,22.86
N$1
  Bottom 0.305: SCL.1 17.14,18.86 18.61,20.32 40.64,20.32 MS1.18
N$2
  Top 0.406: R1.2 45.24,6.11 46.11,5.24 PPS.A
N$3
  Bottom 0.305: SDA.1 19.59,18.86 19.61,19.14 20.37,19.89 42.75,19.89 MS1.17
N$4
  Top 0.406: L1.1 R2.1 46.07,16.66 47.03,17.62 C3.1
N$5
  Bottom 0.406: TX.2 40.32,2.22 MS1.14
N$6
  Bottom 0.406: RX.2 42.7,2.06 MS1.15
N$7
  Bottom 0.406: INT.2 21.75,1.43 MS1.7
N$8
  Top 0.406: D1.C 12.21,5.59 R5.2
N$10  (via drill 0.4)
  Top 0.305: 17.3,12.38 R6.1
  Top 0.406: Q1.2 16.35,13.34 17.3,12.38 | U2.1 15.9,9.87 16.19,10.16 16.19,11.59 16.27,11.67 | R6.1 16.73,12.12 16.43,11.83 16.27,11.67 | D2.C v3.65,16.03 | v15.56,12.38 16.27,11.67
  Bottom 0.406: v3.65,16.03 4.45,16.83 11.11,16.83 v15.56,12.38
RX  (via drill 0.3)
  Top 0.406: U1.43 43.38,5.93 v44.03,5.29
  Bottom 0.305: RX.1 42.91,5.29 v44.03,5.29
RX2  (via drill 0.3)
  Top 0.305: U1.26 23.71,5.93 23.97,6.19 v23.97,7.3
  Bottom 0.305: v23.97,7.3 23.65,7.62 3.81,7.62 RX2.1
SAFEBOOT  (via drill 0.3)
  Top 0.406: U1.50 41.01,13.63 v40.92,13.54
  Bottom 0.305: TP1.P$1 40.21,13.54 v40.92,13.54
SCL  (via drill 0.3)
  Top 0.305: R4.2 16.83,15.56 JP5.1
  Top 0.406: U1.45 43.99,8.13 v44.03,8.09
  Bottom 0.305: v44.03,8.09 43.39,8.09 40.85,10.64 19.84,10.64 16.51,13.97 JP5.1 16.51,17.02 SCL.2
SDA  (via drill 0.3)
  Top 0.305: R3.2 19.37,15.56 JP5.2 v19.05,10.48
  Top 0.406: U1.44 43.9,7.03 v44.03,7.16
  Bottom 0.305: v44.03,7.16 43.48,7.16 40.48,10.16 19.37,10.16 v19.05,10.48 | SDA.2 19.05,17.02 JP5.2
TP  (via drill 0.3)
  Top 0.406: v44.03,9.65 44.9,8.78 R1.1 | v40.92,15.87 40.92,16.34 41.51,16.93 U1.53
  Bottom 0.305: v40.92,15.87 41.38,15.87 42.16,15.09 42.16,10.91 43.41,9.65 v44.03,9.65
TX  (via drill 0.3)
  Top 0.406: U1.42 42.49,4.67 44.64,4.67 v44.65,4.66
  Bottom 0.305: v44.65,4.66 44.8,4.82 44.8,5.75 44.49,6.06 40.51,6.06 40.32,5.87 TX.1
TX2  (via drill 0.3)
  Top 0.305: U1.27 23.56,4.83 v23.97,5.24
  Bottom 0.305: v23.97,5.24 23.97,6.19 23.02,7.14 1.75,7.14 TX2.1
VBACKUP  (via drill 0.4)
  Top 0.406: U1.36 34.03,3.04 33.43,2.43 v32.95,2.43 | B1.+ 5.66,6.19 8.1,6.19 8.95,5.34 C4.1 10.48,5.08 v10.95,4.6 11.64,3.91 11.91,3.91 R5.1
  Bottom 0.406: v32.95,2.43 32.68,2.7 23.81,2.7 23.18,3.33 23.18,6.03 22.7,6.51 20.64,6.51 19.37,5.24 19.37,4.29 19.05,3.97 11.59,3.97 v10.95,4.6
VBAT
  Top 0.406: MS1.28 15.72,21.59 14.13,20 14.13,17.46 13.34,16.67 13.34,12.75 Q1.3
VBUS  (via drill 0.4)
  Top 0.305: CON1.VBUS 10.82,16.91 10.79,16.88
  Top 0.406: 10.79,16.88 10.79,14.76 11.11,14.45 Z4.1 11.79,13.86 11.43,13.49 11.11,13.49 | 11.11,13.49 5.83,13.49 5.35,13.97 Z3.1 3.81,14.45 | MS1.26 21.59,21.43 20.48,20.32 15.4,20.32 14.76,19.68 14.76,17.3 13.97,16.51 13.97,11.75 v14.13,11.59 14.29,11.43 Q1.1 | D2.A 3.77,14.45 3.81,14.45 | R7.2 3.81,14.45 | v11.11,13.34 11.11,13.49
  Bottom 0.406: v11.11,13.34 12.38,13.34 v14.13,11.59
VCC_RF
  Top 0.406: U1.7 32.94,19.71 33.45,20.23 43.57,20.23 R2.2

### Text on the board
Top: TOP
Bottom: BOT
bPlace: SCL | SDA | ZED-F9P | SCL | SDA | GNSS | SAFEBOOT | FeatherWing | 3V3 | RST | GND